# EAGLE design mainboard_reciever.vf0.1 (EAGLE 7.1.0)
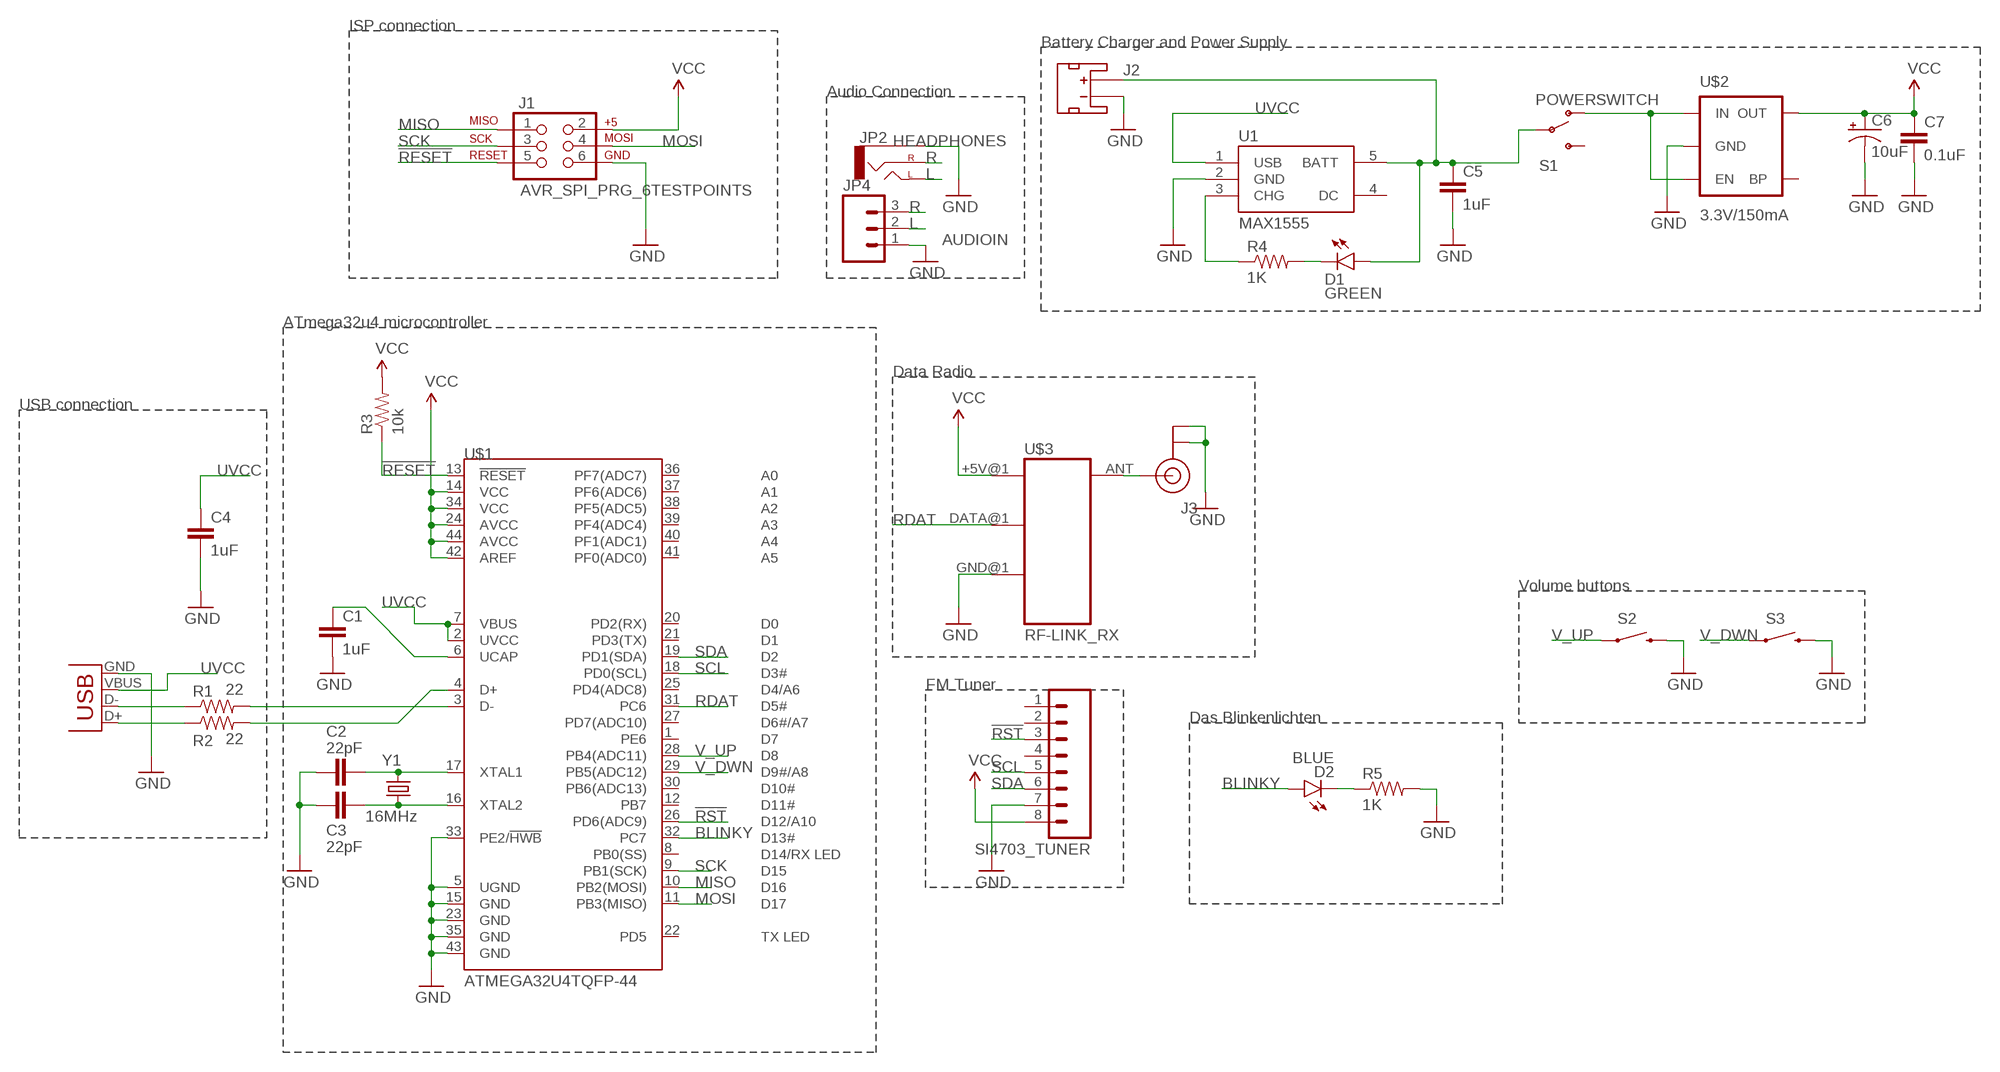
[diagram p0: schematic, sheet 1]

## Parts
C1  1uF  CAP0603-CAP  [0603-CAP]
C2  22pF  CAP0603-CAP  [0603-CAP]
C3  22pF  CAP0603-CAP  [0603-CAP]
C4  1uF  CAP0603-CAP  [0603-CAP]
C5  1uF  1.0UF-16V-10%(0603)  [0603-CAP]
C6  10uF  10UF-25V-20%(PTH)  [CPOL-RADIAL-10UF-25V]
C7  0.1uF  0.1UF-25V(+80/-20%)(0603)  [0603-CAP]
D1  GREEN  LED-GREEN0603  [LED-0603]
D2  BLUE  LED-BLUE0603  [LED-0603]
J1  AVR_SPI_PRG_6TESTPOINTS  [2X3_TEST_POINTS]
J2  BATTERY  JST_2MM_MALE  [JST-2-SMD]
J3  U.FL  [U.FL]
JP1  USBSMD  [USB-MINIB]
JP2  HEADPHONES  AUDIO-JACKPTH  [AUDIO-JACK]
JP4  AUDIOIN  M03PTH  [1X03]
R1  22  RESISTOR0603  [0603-RES]
R2  22  RESISTOR0603  [0603-RES]
R3  10k  10KOHM1/10W1%(0603)0603  [0603-RES]
R4  1K  1KOHM1/10W1%(0603)  [0603-RES]
R5  1K  1KOHM1/10W1%(0603)  [0603-RES]
S1  POWERSWITCH  SWITCH-SPDTSMD2  [SWITCH-SPDT-SMD]
S2  SWITCH-MOMENTARY-2SIDE_EZ  [TACTILE-PTH-SIDEEZ]
S3  SWITCH-MOMENTARY-2SIDE_EZ  [TACTILE-PTH-SIDEEZ]
SI4703_TUNER  M08  [1X08_PIN1_NO_SILK]
U1  MAX1555  [SOT23-5]
U$1  ATMEGA32U4TQFP-44  [TQFP44]
U$2  3.3V/150mA  V_REG_MIC52053.3V  [SOT23-5]
U$3  RF-LINK_RX  [RF-LINK_RX]
Y1  16MHz  CRYSTAL5X3  [CRYSTAL-SMD-5X3]

## Nets
!RESET: J1.5 R3.1 U$1.13(!RESET)
!RST: SI4703_TUNER.3 U$1.26(PD6(ADC9))
BLINKY: D2.A U$1.32(PC7)
GND: C1.2 C2.1 C3.1 C4.2 C5.2 C6.2(-) C7.2 J1.6 J2.1(-) J3.P$1(GND) J3.P$2(GND) JP1.GND JP2.SLEEVE JP4.1 R5.2 S2.2 S3.2 SI4703_TUNER.7 U1.2(GND) U$1.5(UGND) U$1.15(GND) U$1.23(GND) U$1.33(PE2/!HWB) U$1.35(GND) U$1.43(GND) U$2.2(GND) U$3.GND@1(GND)
L: JP2.TIP(LEFT) JP4.2
MISO: J1.1 U$1.10(PB2(MOSI))
MOSI: J1.4 U$1.11(PB3(MISO))
N$1: JP1.D+ R2.1
N$2: JP1.D- R1.1
N$3: R1.2 U$1.3(D-)
N$4: R2.2 U$1.4(D+)
N$5: C1.1 U$1.6(UCAP)
N$6: C2.2 U$1.17(XTAL1) Y1.3
N$7: C3.2 U$1.16(XTAL2) Y1.1
N$8: C5.1 D1.A J2.2(+) S1.2(P) U1.5(BATT)
N$9: D1.C R4.2
N$10: R4.1 U1.3(CHG)
N$11: S1.1(O) U$2.1(IN) U$2.3(EN)
N$12: J3.P$3(SIGNAL) U$3.ANT
N$14: D2.C R5.1
R: JP2.RING(RIGHT) JP4.3
RDAT: U$1.31(PC6) U$3.DATA@1(DATA)
SCK: J1.3 U$1.9(PB1(SCK))
SCL: SI4703_TUNER.5 U$1.18(PD0(SCL))
SDA: SI4703_TUNER.6 U$1.19(PD1(SDA))
UVCC: C4.1 JP1.VBUS U1.1(USB) U$1.2(UVCC) U$1.7(VBUS)
V_DWN: S3.1 U$1.29(PB5(ADC12))
V_UP: S2.1 U$1.28(PB4(ADC11))
VCC: C6.1(+) C7.1 J1.2 R3.2 SI4703_TUNER.8 U$1.14(VCC) U$1.24(AVCC) U$1.34(VCC) U$1.42(AREF) U$1.44(AVCC) U$2.5(OUT) U$3.+5V@1(+5V)
Unconnected: J2.NC1(PAD1) J2.NC2(PAD2) S1.3(S) SI4703_TUNER.1 SI4703_TUNER.2 SI4703_TUNER.4 U1.4(DC) U$1.1(PE6) U$1.8(PB0(SS)) U$1.12(PB7) U$1.20(PD2(RX)) U$1.21(PD3(TX)) U$1.22(PD5) U$1.25(PD4(ADC8)) U$1.27(PD7(ADC10)) U$1.30(PB6(ADC13)) U$1.36(PF7(ADC7)) U$1.37(PF6(ADC6)) U$1.38(PF5(ADC5)) U$1.39(PF4(ADC4)) U$1.40(PF1(ADC1)) U$1.41(PF0(ADC0)) U$2.4(BP)

## Notes on the sheet
- ISP connection
- Battery Charger and Power Supply
- Audio Connection
- ATmega32u4 microcontroller
- Data Radio
- USB connection
- Volume buttons
- FM Tuner
- Das Blinkenlichten

## Library data of the parts
C1-C4 = SparkFun-Capacitors:CAP: Capacitor Standard 0603 ceramic capacitor, and 0.1" leaded capacitor.
C5 = SparkFun-Capacitors:1.0UF-16V-10%(0603): CAP-00868; PROD_ID: CAP-00868; VALUE: 1.0uF
C6 = SparkFun-Capacitors:10UF-25V-20%(PTH): CAP-08440; PROD_ID: CAP-08440
C7 = SparkFun-Capacitors:0.1UF-25V(+80/-20%)(0603): CAP-00810 Ceramic Standard decoupling cap; PROD_ID: CAP-00810
D1 = SparkFun-LED:LED-GREEN: Various green LEDs Green LEDs used in SFE Production 0603- DIO-00821 LARGE- DIO-00862 LILYPAD- DIO-09910; PROD_ID: DIO-00821
D2 = SparkFun-LED:LED-BLUE: Blue LEDs for production use Various blue LEDs stocked by SparkFun production 0603 - DIO-08575 Rebel - DIO-09553 1206 - DIO-09911; PROD_ID: DIO-08575
J1 = SparkFun-Connectors:AVR_SPI_PRG_6: AVR ISP 6 Pin This is the reduced ISP connector for AVR programming. Common on Arduino. This footprint will take up less PCB space and can be used with a 10-pin to 6-pin adapter such as SKU: BOB-08508 **Special note about "TEST_POINT" package. The stop mask is on the top side, so if you want your programming test points to be on the bottom of your board, make sure to place this package on the bottom side of the board. This also ensure that the orientation to program from the bottom side will be correct.
J2 = SparkFun-Connectors:JST_2MM_MALE: Mates to single-cell LiPo batteries. CONN-08352; PROD_ID: CONN-08352
J3 = SparkFun-Connectors:U.FL: SMD antenna connector- WRL-09144; PROD_ID: CONN-09193
JP1 = SparkFun-Connectors:USB: USB Connectors USB-B-PTH is fully proven SKU : PRT-00139/CONN-08278 USB-miniB is fully proven SKU : PRT-00587 USB-A-PCB is untested. USB-A-H is throughly reviewed, but untested. Spark Fun Electronics SKU : PRT-00437 USB-B-SMT is throughly reviewed, but untested. Needs silkscreen touching up. USB-A-S has not been used/tested USB-MB-H has not been used/tested USB-MICROB has been used. CONN-09505; PROD_ID: CONN-08193
JP2 = SparkFun-Connectors:AUDIO-JACK: 3.5mm Audio Jack Simple 3.5mm common PCB mount audio jack. SKU: PRT-08032
JP4 = SparkFun-Connectors:M03: Header 3 Standard 3-pin 0.1" header. Use with straight break away headers (SKU : PRT-00116), right angle break away headers (PRT-00553), swiss pins (PRT-00743), machine pins (PRT-00117), and female headers (PRT-00115). Molex polarized connector foot print use with SKU : PRT-08232 with associated crimp pins and housings.
R1 R2 = SparkFun-Resistors:RESISTOR: Resistor Basic schematic elements and footprints for 0603, 1206, and PTH resistors.
R3 = SparkFun-Resistors:10KOHM1/10W1%(0603): RES-00824; PROD_ID: RES-00824; VALUE: 10K
R4 R5 = SparkFun-Resistors:1KOHM1/10W1%(0603): RES-07856; PROD_ID: RES-07856
S1 = SparkFun-Electromechanical:SWITCH-SPDT: SPDT Switch Simple slide switch, Spark Fun Electronics SKU : COM-00102 DPDT SMT slide switch, AYZ0202, SWCH-08179
S2 S3 = SparkFun-Electromechanical:SWITCH-MOMENTARY-2: Various NO switches- pushbuttons, reed, etc
SI4703_TUNER = SparkFun-Connectors:M08: Header 8 Standard 8-pin 0.1" header. Use with straight break away headers (SKU : PRT-00116), right angle break away headers (PRT-00553), swiss pins (PRT-00743), machine pins (PRT-00117), and female headers (PRT-00115).
U1 = SparkFun-PowerIC:MAX1555: MAX1555 Lithium Charger IC SOT-23 Lithium Polymer charging IC. Schematic element and footprint proven. Spark Fun Electronics SKU : COM-00674
U$1 = SparkFun-DigitalIC:ATMEGA32U4: Atmel 44-pin 8-bit Microcontroller with 32KBytes of ISP Flash and USB Controller
U$2 = SparkFun-PowerIC:V_REG_MIC5205: V_REG MIC5219 Standard 3.3V and 5V 150mA LDO voltage regulator in SOT-23 layout. Micrel part MIC5205. BP (by-pass) pin is used to lower output noise with 470pF cap, may be left open.; PROD_ID: VREG-00822
U$3 = SparkFun-RF:RF-LINK_RX: RF Link receivers- WRL-8947, 8948, 8949, 8950, 10532, 10533
Y1 = SparkFun-FreqCtrl:CRYSTAL: Various standard crystals. Proven footprints. Spark Fun Electronics SKU : COM-00534

## Board
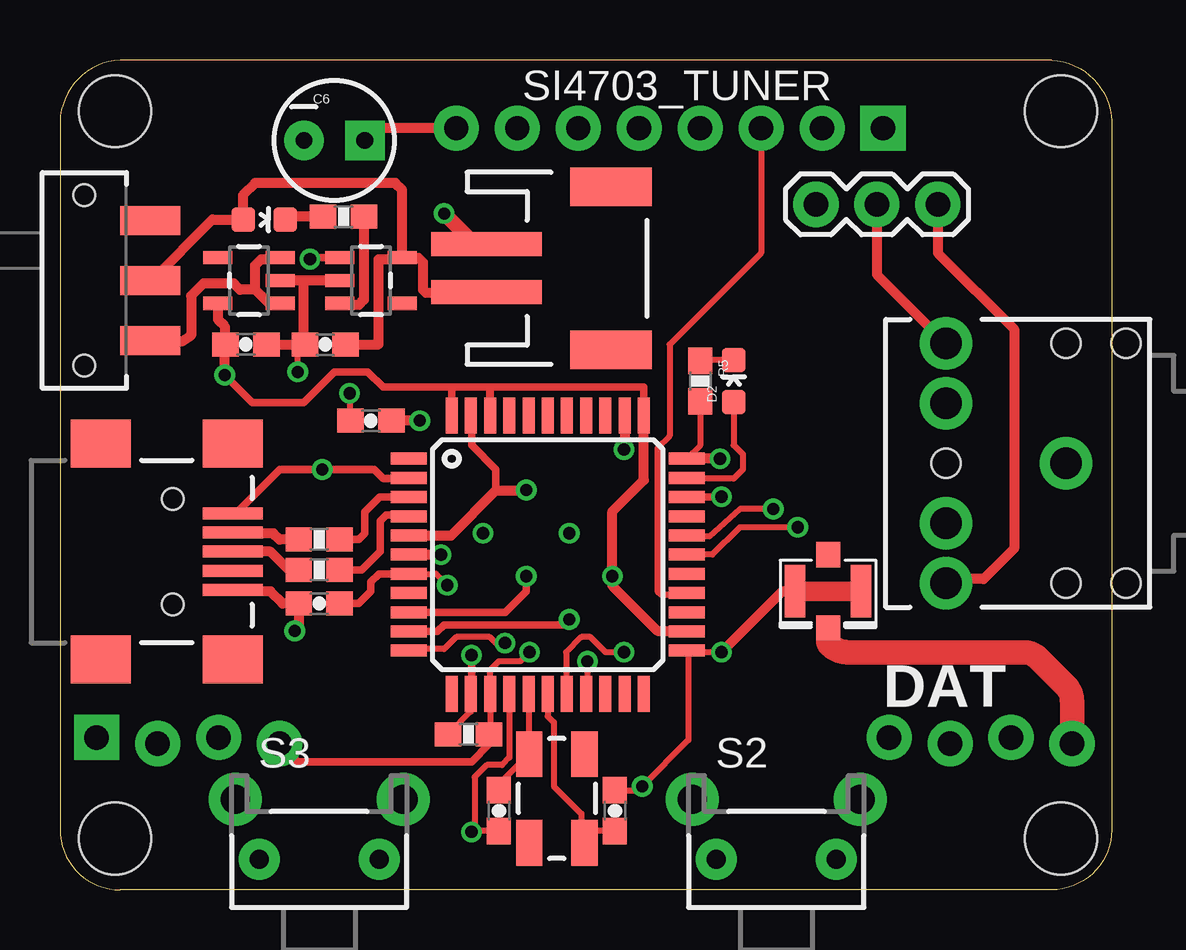
[diagram p1: board, top side]
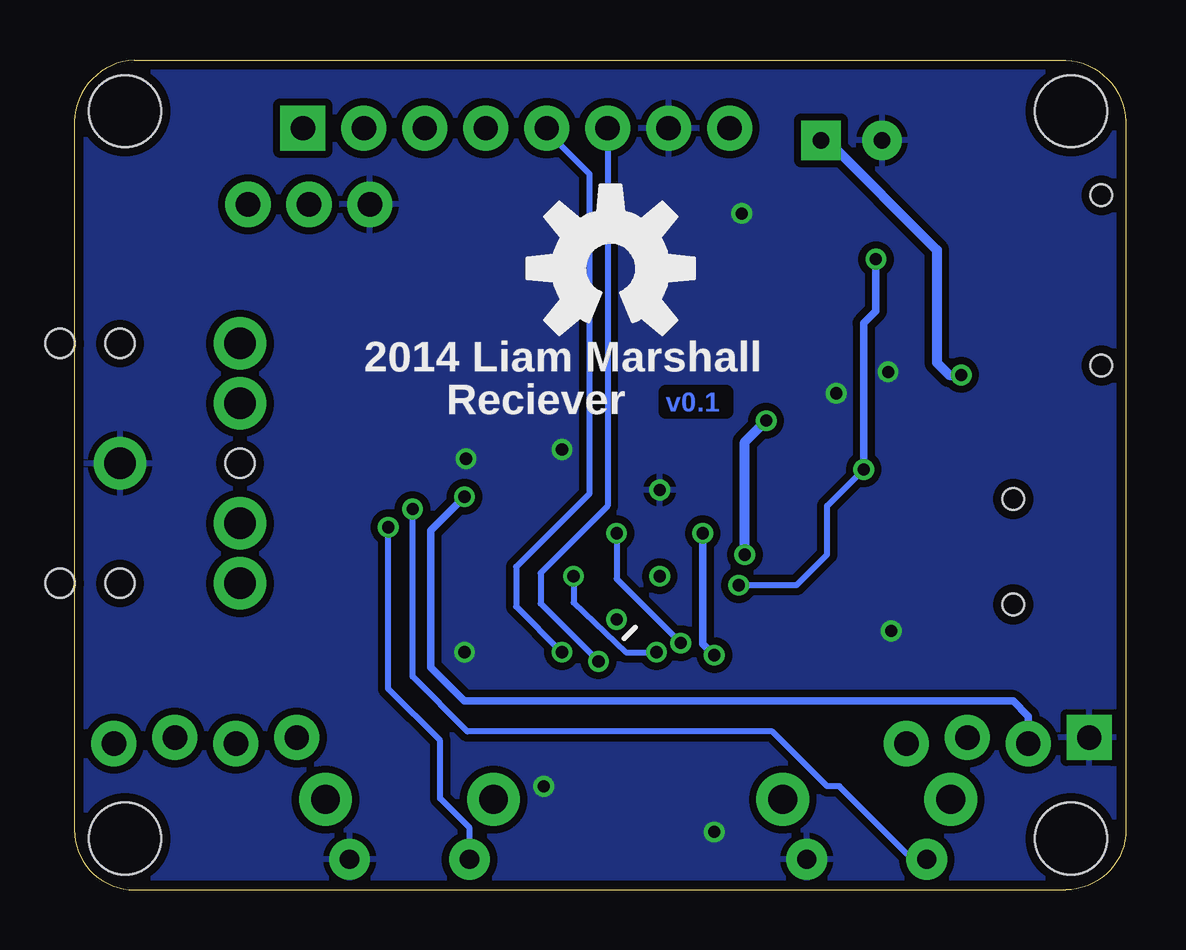
[diagram p2: board, bottom side, seen from below]

Size 43.82 x 34.59 mm. Coordinates in mm from the lower left corner, seen from the top.
Outline: 41.32,34.59 2.5,34.59 arc90 0,31.79 0,2.5 arc90 2.5,0 41.32,0 arc90 43.82,2.5 43.82,31.79 arc90 41.32,34.59
Copper layers (1*16): Top 0.0356mm / dielectric 1.5011mm / Bottom 0.0356mm
Design rules "oshpark-2layer": minimum track width 6mil, minimum drill 13mil, track to track 6mil, track to pad 6mil, pad to pad 6mil, via to via 6mil, smd to smd 6mil, copper to edge 15mil, drill to drill 6mil, minimum pad ring 7mil, minimum via ring 7mil, stop-mask expansion 4mil, vias tented up to drill 0mil, thermal gap 10mil
Holes 3 mm at 2.29,2.13 41.71,2.13 41.71,32.46 2.29,32.46

### Footprints (pad centres in the part's own frame; a part is rotated, then mirrored left to right if it is on the bottom)
0603-CAP = smd 1.1 x 1: 1 -0.85,0; 2 0.85,0
CPOL-RADIAL-10UF-25V = drill 0.7 pad 1.651 square: 1 1.27,0 | drill 0.7 pad 1.651: 2 -1.27,0
LED-0603 = smd 1 x 1: A 0,-0.877; C 0,0.877
2X3_TEST_POINTS = drill 0.508: 1 -2.54,-1.27; 2 -2.54,1.27; 3 0,-1.27; 4 0,1.27; 5 2.54,-1.27; 6 2.54,1.27
JST-2-SMD = smd 1 x 4.6: 1 -1,-3.7; 2 1,-3.7 | smd 1.6 x 3.4: NC1 -3.4,1.5; NC2 3.4,1.5
U.FL = smd 2.2 x 0.85: P$1 0,1.375; P$2 0,-1.375 | smd 1.05 x 1: P$3 1.525,0; P$4 -1.525,0
USB-MINIB = smd 2.5 x 0.5: D+ 2.5,0; D- 2.5,0.8; GND 2.5,-1.6; ID 2.5,-0.8; VBUS 2.5,1.6 | smd 2.5 x 2: MTN1 -3,4.5; MTN2 2.5,4.5; MTN3 -3,-4.5; MTN4 2.5,-4.5 | hole 0.9: 0,2.2; 0,-2.2
AUDIO-JACK = drill 1.3 pad 2.184: RING 5,5; RSH 5,2.5; SLEEVE 0,0; TIP 5,-5; TSH 5,-2.5 | hole 1.2: 0,5; -2.5,5; -2.5,-5; 0,-5; 5,0
1X03 = drill 1.016 pad 1.88: 1 0,0; 2 2.54,0; 3 5.08,0
0603-RES = smd 1.1 x 1: 1 -0.85,0; 2 0.85,0
SWITCH-SPDT-SMD = smd 1.2 x 2.5: 1 -2.5,-2.75; 2 0,-2.75; 3 2.5,-2.75 | hole 0.9: -3.55,0; 3.55,0
TACTILE-PTH-SIDEEZ = drill 0.8 pad 1.7: 1 -2.5,0; 2 2.5,0 | drill 1.2 pad 2.2: ANCHOR1 -3.5,2.5; ANCHOR2 3.5,2.5
1X08_PIN1_NO_SILK = drill 1.016 pad 1.88 square: 1 0,0 | drill 1.016 pad 1.88: 2 2.54,0; 3 5.08,0; 4 7.62,0; 5 10.16,0; 6 12.7,0; 7 15.24,0; 8 17.78,0
SOT23-5 = smd 0.55 x 1.2: 1 -0.95,-1.3; 2 0,-1.3; 3 0.95,-1.3; 4 0.95,1.3; 5 -0.95,1.3
TQFP44 = smd 1.5 x 0.5: 1 -5.8,4; 2 -5.8,3.2; 3 -5.8,2.4; 4 -5.8,1.6; 5 -5.8,0.8; 6 -5.8,0; 7 -5.8,-0.8; 8 -5.8,-1.6; 9 -5.8,-2.4; 10 -5.8,-3.2; 11 -5.8,-4; 23 5.8,-4; 24 5.8,-3.2; 25 5.8,-2.4; 26 5.8,-1.6; 27 5.8,-0.8; 28 5.8,0; 29 5.8,0.8; 30 5.8,1.6; 31 5.8,2.4; 32 5.8,3.2; 33 5.8,4 | smd 0.5 x 1.5: 12 -4,-5.8; 13 -3.2,-5.8; 14 -2.4,-5.8; 15 -1.6,-5.8; 16 -0.8,-5.8; 17 0,-5.8; 18 0.8,-5.8; 19 1.6,-5.8; 20 2.4,-5.8; 21 3.2,-5.8; 22 4,-5.8; 34 4,5.8; 35 3.2,5.8; 36 2.4,5.8; 37 1.6,5.8; 38 0.8,5.8; 39 0,5.8; 40 -0.8,5.8; 41 -1.6,5.8; 42 -2.4,5.8; 43 -3.2,5.8; 44 -4,5.8
RF-LINK_RX = drill 1.016 pad 1.88: +5V@1 7.62,-0.127; +5V@2 33.02,0.127; ANT 40.64,-0.127; DATA@1 2.54,-0.127; DATA@2 5.08,0.127; GND@2 35.56,-0.127; GND@3 38.1,0.127 | drill 1.016 pad 1.88 square: GND@1 0,0.127
CRYSTAL-SMD-5X3 = smd 1.9 x 1.1: 1 -1.85,-1.15; 2 1.85,-1.15; 3 1.85,1.15; 4 -1.85,1.15

### Placement (x,y rotation side)
C1  12.96,19.56 180 top
C2  23.12,3.3 270 top
C3  18.29,3.3 90 top
C4  10.8,11.94 180 top
C5  11.05,22.73 180 top
C6  11.43,31.24 0 top
C7  7.75,22.73 0 top
D1  8.51,27.94 270 top
D2  28.07,21.21 0 top
J1  20.32,13.97 45 bottom
J2  21.47,25.91 270 top
J3  32.01,12.45 270 top
JP1  4.7,14.1 0 top
JP2  41.91,17.78 180 top
JP4  31.5,28.57 0 top
R1  10.8,14.6 0 top
R2  10.8,13.33 0 top
R3  17.02,6.48 0 top
R4  11.81,28.07 180 top
R5  26.67,21.21 270 top
S1  1.02,25.4 90 top
S2  29.85,1.27 0 top
S3  10.8,1.27 0 top
SI4703_TUNER  34.29,31.75 180 top
U1  12.96,25.4 270 top
U$1  20.32,13.97 0 top
U$2  7.88,25.4 90 top
U$3  1.53,6.22 0 top
U$4  [OSHW-LOGO-L]  21.47,25.91 0 bottom
Y1  20.7,3.81 270 top

### Tracks (layer width: path | path; a pad name or v marks a point on that pad's centre or on a via)
!RESET  (via drill 0.51)
  Top 0.254: U$1.13 17.12,7.43 R3.1
  Top 0.305: v17.15,9.78 17.15,8.2 U$1.13
  Bottom 0.305: J1.5 17.63,10.26 v17.15,9.78
!RST
  Top 0.254: SI4703_TUNER.3 29.21,26.54 25.4,22.73 25.4,18.92 24.89,18.42 24.89,12.45 25.02,12.32 26.07,12.32 U$1.26
BLINKY
  Top 0.254: D2.A 28.07,18.54 28.45,18.16 28.45,17.53 28.07,17.14 26.15,17.14 U$1.32
GND  (via drill 0.51)
  Top 0.254: v12.07,20.7 12.07,19.6 C1.2 | v9.91,21.59 9.91,22.44 C5.2 | v27.56,9.91 26.19,9.91 | 26.19,9.91 U$1.23 | C3.1 17.19,2.45 v17.15,2.41 17.27,2.54 17.27,4.7 17.78,5.21 18.42,5.21 18.72,5.51 U$1.15 | C2.1 24.09,4.15 v24.26,4.32 26.19,6.24 26.19,9.91 | R5.2 26.67,18.52 U$1.33
  Top 0.305: 18.16,16.64 18.16,17.53 17.15,18.54 17.15,19.75 U$1.43
  Top 0.406: U1.2 10.16,25.4 | 10.16,25.4 U$2.2 | 10.16,25.4 10.16,22.99 C5.2 C7.2 | J2.1 17.29,26.91 | JP1.GND 7.25,12.45 8.77,12.45 9.27,11.94 C4.2 9.95,10.96 v9.78,10.79 | U$1.5 16.3,14.77 18.16,16.64 19.4,16.64 J1.6 | v27.5,17.97 U$1.33 | U$1.33 | U$1.35 23.52,18.38 v23.5,18.35 | J3.P$2 30.1,12.45 v27.56,9.91
  Top 0.61: 17.29,26.91 v16,28.19
  Top 0.813: J3.P$1 J3.P$2
  pour Bottom (isolate 0.305): 49.53,-3.81 -3.81,-3.81 -3.81,35.56 49.53,35.56
L
  Top 0.406: JP4.2 34.04,25.65 JP2.TIP
MISO
  Top 0.305: U$1.10 15.73,10.77 16,11.05 20.96,11.05 J1.1
MOSI  (via drill 0.51)
  Top 0.254: v18.54,10.29 18.16,10.29 17.91,10.54 16.51,10.54 16,10.03 14.59,10.03 U$1.11
  Bottom 0.254: J1.4 21.22,12.96 v18.54,10.29
N$1
  Top 0.406: R2.1 9.53,13.33 8.77,14.1 JP1.D+
N$2
  Top 0.406: R1.1 9.15,14.6 8.89,14.86 7.24,14.86 JP1.D-
N$3
  Top 0.305: U$1.3 13.32,16.37 12.7,15.75 12.7,14.86 12.45,14.6 R1.2
N$4
  Top 0.305: R2.2 12.58,13.33 13.34,14.1 13.34,15.37 13.59,15.62 14.47,15.62 U$1.4
N$5  (via drill 0.51)
  Top 0.406: U$1.6 v15.88,13.97 | v14.99,19.56 C1.1
  Bottom 0.406: v15.88,13.97 15.88,18.67 v14.99,19.56
N$6
  Top 0.254: C2.2 22.35,2.45 Y1.3 21.72,2.09 21.72,3.18 20.58,4.32 20.58,6.98 20.32,7.24 U$1.17
N$7
  Top 0.254: C3.2 18.29,4.4 Y1.1 19.52,5.69 U$1.16
N$8
  Top 0.406: C5.1 13.27,22.73 13.27,26.29 14.2,26.29 U1.5 | S1.2 3.81,25.4 6.35,27.94 D1.A 7.62,27.95 7.62,28.96 8.13,29.46 13.97,29.46 14.26,29.18 U1.5 | U1.5 14.93,26.35 15.12,26.16 15.12,25.02 15.24,24.89 17.75,24.89 J2.2
N$9
  Top 0.406: R4.2 9.52,28.07 D1.C
N$10
  Top 0.406: R4.1 12.66,24.6 12.45,24.38 11.72,24.38 U1.3
N$11
  Top 0.406: U$2.1 8.7,24.45 8.13,25.02 | 8.13,25.02 8.13,26.04 8.38,26.29 9.12,26.29 U$2.3 | 8.13,25.02 7.5,25.02 7.24,25.27 5.97,25.27 5.46,24.77 5.46,23.11 5.08,22.86 4.06,22.86 S1.1
N$12
  Top 1.016: U$3.ANT 42.17,7.84 arc45 41.87,8.55 40.81,9.61 arc45 40.1,9.91 32.8,9.91 arc-45 32.09,10.2 arc-45 32.01,10.41 J3.P$3
N$14
  Top 0.254: D2.C 26.7,22.09 R5.1
R
  Top 0.406: JP4.3 36.58,26.54 39.75,23.37 39.75,14.22 38.48,12.95 37.09,12.95 JP2.RING
RDAT  (via drill 0.51)
  Top 0.305: v27.56,16.38 26.14,16.38 U$1.31
  Bottom 0.305: U$3.DATA@1 4.07,7.24 4.7,7.87 27.56,7.87 28.96,9.27 28.96,14.99 v27.56,16.38
SCK
  Top 0.305: J1.3 19.42,12.44 18.54,11.56 14.54,11.56 U$1.9
SCL  (via drill 0.51)
  Top 0.254: v23.5,9.91 22.74,9.91 22.1,10.54 21.72,10.54 21.08,9.91 21.08,8.21 U$1.18
  Bottom 0.254: SI4703_TUNER.5 24.13,31.62 22.35,29.85 22.35,16.51 25.4,13.46 25.4,11.81 v23.5,9.91
SDA  (via drill 0.51)
  Top 0.254: v21.97,9.53 21.97,8.22 U$1.19
  Bottom 0.254: SI4703_TUNER.6 21.59,16 24.39,13.21 24.39,11.94 v21.97,9.53
UVCC  (via drill 0.51)
  Top 0.254: U$1.7 15.66,13.17 v16.13,12.7
  Top 0.305: U$1.7 13.3,13.17 12.96,12.83 12.96,12.45 12.45,11.94 C4.1 | JP1.VBUS 7.32,15.7 9.15,17.53 v10.92,17.53 13.08,17.53 13.46,17.14 14.5,17.14 U$1.2 | U1.1 10.48,26.35 v10.42,26.29
  Bottom 0.254: v16.13,12.7 13.72,12.7 12.45,13.97 12.45,16 v10.92,17.53
  Bottom 0.305: v10.42,26.29 10.42,24.13 10.92,23.62 v10.92,17.53
V_DWN  (via drill 0.51)
  Top 0.254: v29.72,15.87 28.32,15.87 27.05,14.73 26.16,14.73 U$1.29
  Bottom 0.254: S3.1 8.89,1.27 11.94,4.32 12.45,4.32 14.73,6.6 27.43,6.6 29.72,8.89 v29.72,15.87
V_UP  (via drill 0.51)
  Top 0.254: v30.74,15.11 28.32,15.11 27.18,13.97 U$1.28
  Bottom 0.254: S2.1 27.35,2.58 28.58,3.81 28.58,6.22 30.74,8.38 v30.74,15.11
VCC  (via drill 0.51)
  Top 0.254: R3.2 17.92,6.53 U$1.14 17.91,8.18 17.91,9.14 18.29,9.53 19.18,9.53 v19.56,9.91
  Top 0.305: U$1.34 24.32,19.83 24.32,20.96 17.92,20.96 U$1.42 17.91,19.77 17.91,20.96 16.32,20.96 | 16.32,20.96 U$1.44 16.32,20.89 16.32,20.96 | 16.32,20.96 13.46,20.96 12.83,21.59 11.43,21.59 10.16,20.32 8,20.32 v6.86,21.46 | R3.2 17.87,6.06 17.15,5.33 9.91,5.33 U$3.+5V@1
  Top 0.406: U$2.5 6.58,23.78 6.86,23.5 6.86,22.77 C7.1 6.86,22.69 v6.86,21.46 | SI4703_TUNER.8 13.21,31.75 C6.1 | U$1.24 26.1,10.79 24.89,10.79 23.02,12.67 J1.2 23.02,15.78 24.32,17.08 24.32,19.64 U$1.34
  Bottom 0.254: J1.2 23.02,11.96 20.83,9.91 v19.56,9.91
  Bottom 0.406: C6.1 12.45,31.24 7.88,26.67 7.88,21.97 7.37,21.46 v6.86,21.46

### Text on the board
Bottom: v0.1
tPlace: DAT
bPlace: 2014 Liam Marshall | Reciever
tStop: gamma-FM H^2 | vf0.1 | 2014 Liam Marshall
bStop: v0.1 | vf0.1